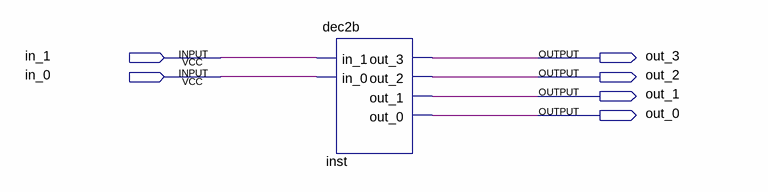
[diagram p0: schematic sheet]
// Quartus schematic cu2b.bdf as structural Verilog: 1 symbols, 6 pins
module cu2b (
  input  in_1,
  input  in_0,
  output out_3,
  output out_2,
  output out_1,
  output out_0
);

  dec2b inst (.in_1(in_1), .in_0(in_0), .out_3(out_3), .out_2(out_2), .out_1(out_1), .out_0(out_0));
endmodule
